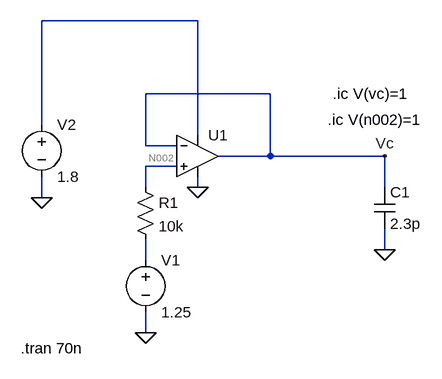
[diagram p0: schematic transient_ideal.asc]
transient_ideal.asc, the LTspice schematic file:
Version 4
SHEET 1 1008 680
WIRE 160 -48 -80 -48
WIRE 272 64 80 64
WIRE -80 112 -80 -48
WIRE 160 128 160 -48
WIRE 80 144 80 64
WIRE 128 144 80 144
WIRE 272 160 272 64
WIRE 272 160 192 160
WIRE 448 160 272 160
WIRE 128 176 80 176
WIRE 80 208 80 176
WIRE 160 208 160 192
WIRE 448 208 448 160
WIRE -80 224 -80 192
WIRE 448 304 448 272
WIRE 80 320 80 288
WIRE 80 432 80 400
FLAG 80 432 0
FLAG 160 208 0
FLAG -80 224 0
FLAG 448 304 0
FLAG 448 160 Vc
SYMBOL res 64 192 R0
SYMATTR InstName R1
SYMATTR Value 10k
SYMBOL voltage 80 304 R0
WINDOW 123 0 0 Left 0
WINDOW 39 0 0 Left 0
SYMATTR InstName V1
SYMATTR Value 1.25
SYMBOL voltage -80 96 R0
WINDOW 123 0 0 Left 0
WINDOW 39 0 0 Left 0
SYMATTR InstName V2
SYMATTR Value 1.8
SYMBOL cap 432 208 R0
SYMATTR InstName C1
SYMATTR Value 2.3p
SYMBOL OpAmps\\UniversalOpAmp2 160 160 R0
SYMATTR InstName U1
SYMATTR Value2 Avol=1500 GBW=40Meg Slew=10Meg
SYMATTR SpiceLine Ilimit=35m Rail=0.2 Vos=200m
TEXT -112 456 Left 2 !.tran 70n
TEXT 360 104 Left 2 !.ic V(n002)=1
TEXT 368 64 Left 2 !.ic V(vc)=1

The netlist it stands for:
* transient_ideal.asc
R1 N002 N003 10k
V1 N003 0 1.25
V2 N001 0 1.8
C1 Vc 0 2.3p
XU1 N002 Vc N001 0 Vc level2 Avol=1500 GBW=40Meg Slew=10Meg Ilimit=35m Rail=0.2 Vos=200m En=0 Enk=0 In=0 Ink=0 Rin=500Meg  ; pins In+ In- V+ V- OUT
.tran 70n
.ic V(n002)=1
.ic V(vc)=1
.lib UniversalOpAmp2.lib
.backanno
.end